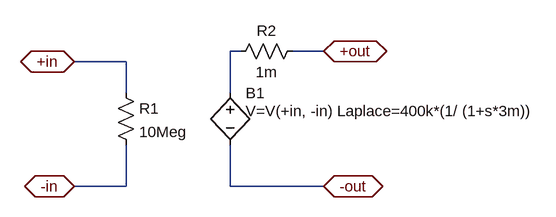
[diagram p0: schematic OpAmp.asc]
OpAmp.asc, the LTspice schematic file:
Version 4
SHEET 1 1124 680
WIRE 96 -64 80 -64
WIRE 224 -64 176 -64
WIRE -80 -48 -160 -48
WIRE -80 0 -80 -48
WIRE 80 0 80 -64
WIRE -80 144 -80 80
WIRE -80 144 -160 144
WIRE 80 144 80 80
WIRE 224 144 80 144
FLAG -160 -48 +in
IOPIN -160 -48 BiDir
FLAG -160 144 -in
IOPIN -160 144 BiDir
FLAG 224 -64 +out
IOPIN 224 -64 BiDir
FLAG 224 144 -out
IOPIN 224 144 BiDir
SYMBOL bv 80 -16 R0
WINDOW 3 24 44 Left 0
SYMATTR Value V=V(+in, -in) Laplace=400k*(1/ (1+s*3m))
SYMATTR InstName B1
SYMBOL res -96 -16 R0
SYMATTR InstName R1
SYMATTR Value 10Meg
SYMBOL res 192 -80 R90
WINDOW 0 0 56 VBottom 0
WINDOW 3 32 56 VTop 0
SYMATTR InstName R2
SYMATTR Value 1m

The netlist it stands for:
* OpAmp.asc
B1 N001 -out V=V(+in, -in) Laplace=400k*(1/ (1+s*3m))
R1 +in -in 10Meg
R2 +out N001 1m
.backanno
.end